# Altium schematic sheet ELEC-DEM-555Timer.SchDoc
size A4
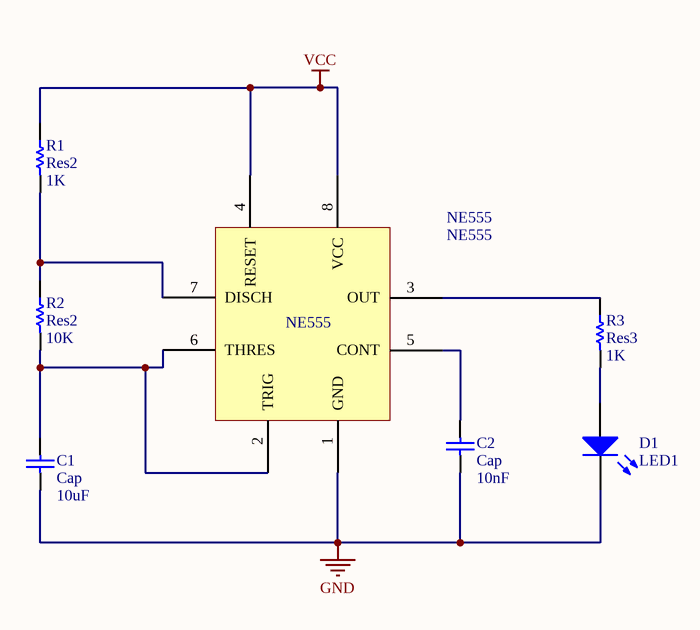
[diagram p0: ELEC-DEM-555Timer.SchDoc]

## Parts
C1  Cap  value 10uF  [RAD-0.3]
C2  Cap  value 10nF  [RAD-0.3]
D1  LED1  [LED-1]
NE555  NE555
R1  Res2  value 1K  [AXIAL-0.3]
R2  Res2  value 10K  [AXIAL-0.3]
R3  Res3  value 1K  [AXIAL-0.3]

## Nets
GND: C1.2 C2.2 D1.2(K) NE555.1(GND)
VCC: NE555.4(RESET) NE555.8(VCC) R1.1
NetC1_1: C1.1 NE555.2(TRIG) NE555.6(THRES) R2.2
NetC2_1: C2.1 NE555.5(CONT)
NetD1_1: D1.1(A) R3.2
NetNE555_3: NE555.3(OUT) R3.1
NetNE555_7: NE555.7(DISCH) R1.2 R2.1

## Library data of the parts
C1 C2 = Cap: Capacitor; Published: 8-Jun-2000; LatestRevisionDate: 17-Jul-2002; LatestRevisionNote: Re-released for DXP Platform.; PackageReference: RAD-0.3; Publisher: Altium Limited; PackageDescription: Radial Cap, Thru-Hole; 2 Leads; 0.3 in Pin Spacing
D1 = LED1: Typical RED GaAs LED; Published: 8-Jun-2000; LatestRevisionDate: 08-Jul-2005; LatestRevisionNote: Mech Layer 1 removed.; PackageReference: LED-1; Publisher: Altium Limited; PackageDescription: LED; 2 Leads
R1-R3 = Res1: Resistor; Published: 8-Jun-2000; LatestRevisionDate: 17-Jul-2002; LatestRevisionNote: Re-released for DXP Platform.; PackageReference: AXIAL-0.3; Publisher: Altium Limited; PackageDescription: Axial Device, Thru-Hole; 2 Leads; 0.3 in Pin Spacing